# Altium schematic sheet STM32VET6.SchDoc
size A4; Organization: Altium Limited; Address1: 3 Minna Close; Address2: Belrose; Address3: NSW 2085; Address4: Australia; DocumentNumber: 1; SheetNumber: 1; SheetTotal: 1
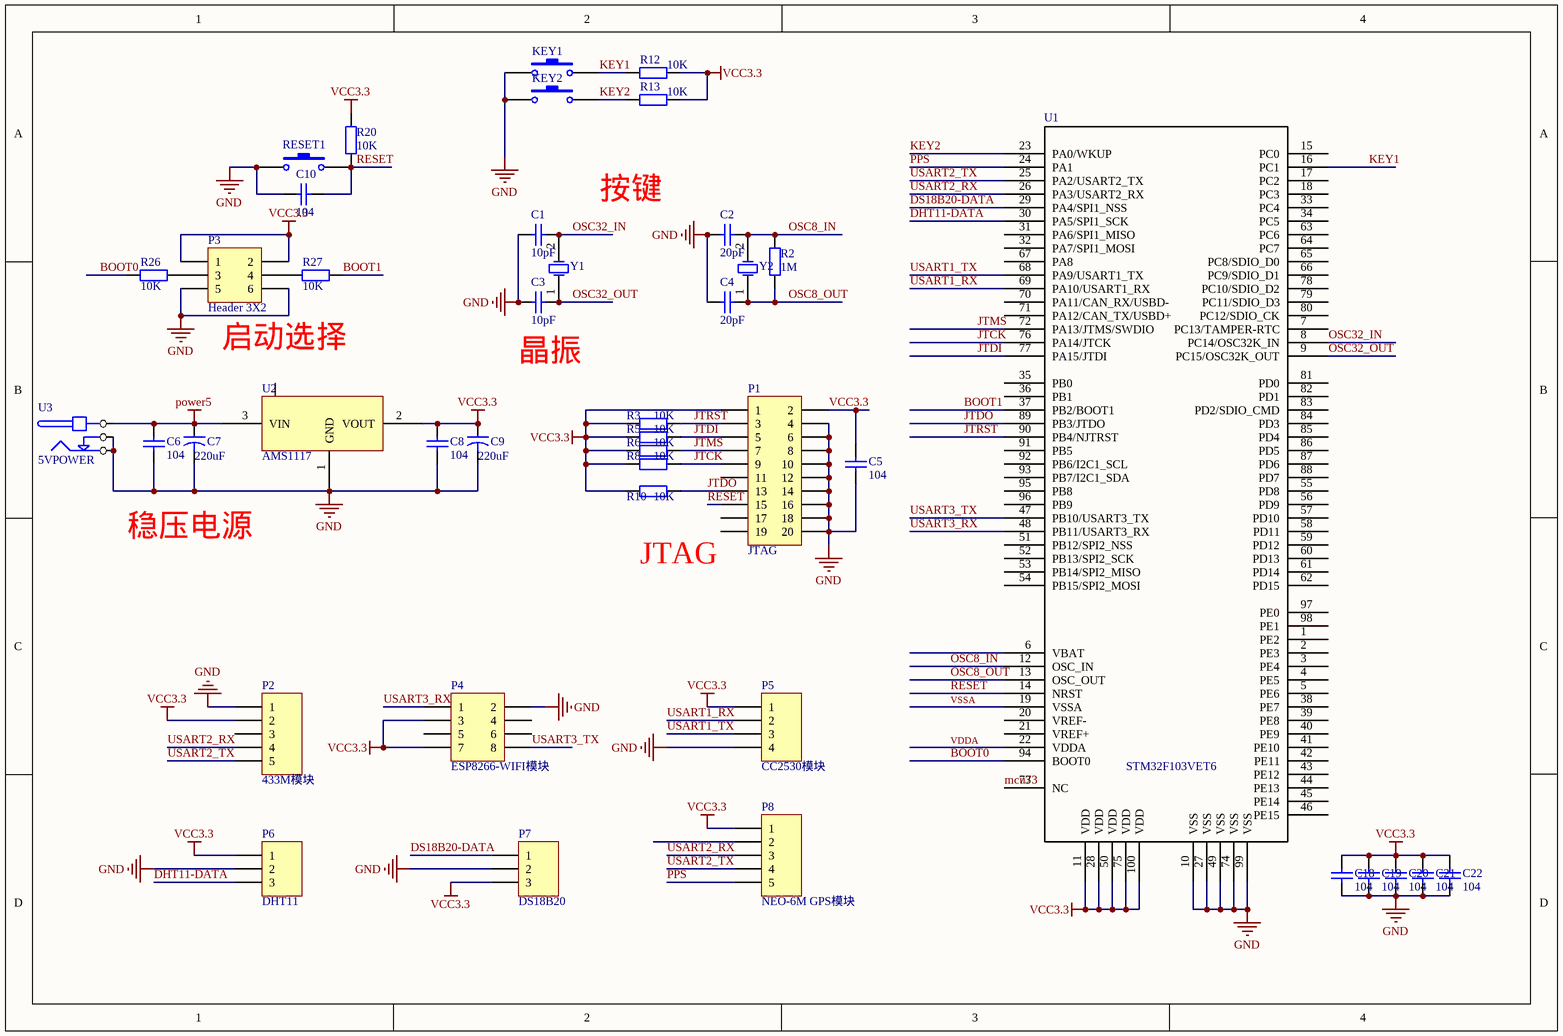
[diagram p0: STM32VET6.SchDoc]

## Parts
C1  value 10pF  [0805]  (hidden comment: Cap)
C2  value 20pF  [0805]  (hidden comment: Cap)
C3  value 10pF  [0805]  (hidden comment: Cap)
C4  value 20pF  [0805]  (hidden comment: Cap)
C5  value 104  [0805]  (hidden comment: Cap)
C6  value 104  [0805]  (hidden comment: Cap)
C7  value 220uF  [非0805贴片电容]  (hidden comment: Cap2)
C8  value 104  [0805]  (hidden comment: Cap)
C9  value 220uF  [非0805贴片电容]  (hidden comment: Cap2)
C10  value 104  [0805]  (hidden comment: Cap)
C18  value 104  [0805]  (hidden comment: Cap)
C19  value 104  [0805]  (hidden comment: Cap)
C20  value 104  [0805]  (hidden comment: Cap)
C21  value 104  [0805]  (hidden comment: Cap)
C22  value 104  [0805]  (hidden comment: Cap)
KEY1  SW-PB  [PUSHSW]  (value not drawn)
KEY2  SW-PB  [PUSHSW]  (value not drawn)
P1  JTAG  [HDR2X10]
P2  433M模块  [HDR1X5]
P3  Header 3X2  [HDR2X3]
P4  ESP8266-WIFI模块  [HDR2X4]
P5  CC2530模块  [HDR1X4]
P6  DHT11  [HDR1X3]
P7  DS18B20  [HDR1X3]
P8  NEO-6M GPS模块  [HDR1X5]
R2  value 1M  [0805]  (hidden comment: Res2)
R3  value 10K  [0805]  (hidden comment: Res2)
R5  value 10K  [0805]  (hidden comment: Res2)
R6  value 10K  [0805]  (hidden comment: Res2)
R8  value 10K  [0805]  (hidden comment: Res2)
R10  value 10K  [0805]  (hidden comment: Res2)
R12  value 10K  [0805]  (hidden comment: Res2)
R13  value 10K  [0805]  (hidden comment: Res2)
R20  value 10K  [0805]  (hidden comment: Res2)
R26  value 10K  [0805]  (hidden comment: Res2)
R27  value 10K  [0805]  (hidden comment: Res2)
RESET1  SW-PB  [PUSHSW]  (value not drawn)
U1  STM32F103VET6  [LQFP100]
U2  AMS1117  [SPX1117M]
U3  5VPOWER  [power3_1]
Y1  XTAL  [SM8]  (value not drawn)
Y2  XTAL  [XTAL-2]  (value not drawn)

## Nets
GND: C1.1 C2.1 C3.1 C4.1 C5.1 C6.1 C7.2 C8.1 C9.2 C10.1 C18.1 C19.1 C20.1 C21.1 C22.1 KEY1.1 KEY2.1 P1.4 P1.6 P1.8 P1.10 P1.12 P1.14 P1.16 P1.18 P1.20 P2.1 P3.5 P3.6 P4.2 P5.4 P6.2 P7.2 RESET1.2 U1.10(VSS) U1.27(VSS) U1.49(VSS) U1.74(VSS) U1.99(VSS) U2.1(GND) U3.1 U3.2
power5: C6.2 C7.1 U2.3(VIN) U3.3
VCC3.3: C5.2 C8.2 C9.1 C18.2 C19.2 C20.2 C21.2 C22.2 P1.1 P1.2 P2.2 P3.1 P3.2 P4.3 P4.7 P5.1 P6.1 P7.3 P8.1 R3.2 R5.2 R6.2 R8.2 R10.2 R12.1 R13.1 R20.1 U1.11(VDD) U1.28(VDD) U1.50(VDD) U1.75(VDD) U1.100(VDD) U2.2(VOUT)
BOOT0: R26.1 U1.94(BOOT0)
BOOT1: R27.2 U1.37(PB2/BOOT1)
DHT11-DATA: P6.3 U1.30(PA5/SPI1_SCK)
DS18B20-DATA: P7.1 U1.29(PA4/SPI1_NSS)
JTCK: P1.9 R8.1 U1.76(PA14/JTCK)
JTDI: P1.5 R5.1 U1.77(PA15/JTDI)
JTDO: P1.13 R10.1 U1.89(PB3/JTDO)
JTMS: P1.7 R6.1 U1.72(PA13/JTMS/SWDIO)
JTRST: P1.3 R3.1 U1.90(PB4/NJTRST)
KEY1: KEY1.2 R12.2 U1.16(PC1)
KEY2: KEY2.2 R13.2 U1.23(PA0/WKUP)
mcu73: U1.73(NC)
OSC8_IN: C2.2 R2.2 U1.12(OSC_IN) Y2.2(OSC2)
OSC8_OUT: C4.2 R2.1 U1.13(OSC_OUT) Y2.1(OSC1)
OSC32_IN: C1.2 U1.8(PC14/OSC32K_IN) Y1.2(OSC2)
OSC32_OUT: C3.2 U1.9(PC15/OSC32K_OUT) Y1.1(OSC1)
PPS: P8.5 U1.24(PA1)
RESET: C10.2 P1.15 R20.2 RESET1.1 U1.14(NRST)
USART1_RX: P5.2 U1.69(PA10/USART1_RX)
USART1_TX: P5.3 U1.68(PA9/USART1_TX)
USART2_RX: P2.4 P8.3 U1.26(PA3/USART2_RX)
USART2_TX: P2.5 P8.4 U1.25(PA2/USART2_TX)
USART3_RX: P4.1 U1.48(PB11/USART3_RX)
USART3_TX: P4.8 U1.47(PB10/USART3_TX)
VDDA: U1.22(VDDA)
VSSA: U1.19(VSSA)
NetP3_3: P3.3 R26.2
NetP3_4: P3.4 R27.1

Not connected (* = marked no-connect by the designer): P1 11 17 19; P2 3; P4 4 5 6; P8 2; U1 1(PE2) 2(PE3) 3(PE4) 4(PE5) 5(PE6) 6(VBAT) 7(PC13/TAMPER-RTC) 15(PC0) 17(PC2) 18(PC3) 20(VREF-) 21(VREF+) 31(PA6/SPI1_MISO) 32(PA7/SPI1_MOSI) 33(PC4) 34(PC5) 35(PB0) 36(PB1) 38(PE7) 39(PE8) 40(PE9) 41(PE10) 42(PE11) 43(PE12) 44(PE13) 45(PE14) 46(PE15) 51(PB12/SPI2_NSS) 52(PB13/SPI2_SCK) 53(PB14/SPI2_MISO) 54(PB15/SPI2_MOSI) 55(PD8) 56(PD9) 57(PD10) 58(PD11) 59(PD12) 60(PD13) 61(PD14) 62(PD15) 63(PC6) 64(PC7) 65(PC8/SDIO_D0) 66(PC9/SDIO_D1) 67(PA8) 70(PA11/CAN_RX/USBD-) 71(PA12/CAN_TX/USBD+) 78(PC10/SDIO_D2) 79(PC11/SDIO_D3) 80(PC12/SDIO_CK) 81(PD0) 82(PD1) 83(PD2/SDIO_CMD) 84(PD3) 85(PD4) 86(PD5) 87(PD6) 88(PD7) 91(PB5) 92(PB6/I2C1_SCL) 93(PB7/I2C1_SDA) 95(PB8) 96(PB9) 97(PE0) 98(PE1)

## Notes on the sheet
- 按键
- 启动选择
- (near C3) 晶振
- 稳压电源
- JTAG

## Library data of the parts
C1-C6 C8 C10 C18-C22 = Cap: Capacitor; Published: 8-Jun-2000; LatestRevisionDate: 17-Jul-2002; LatestRevisionNote: Re-released for DXP Platform.; PackageReference: RAD-0.3; Publisher: Altium Limited
C7 C9 = Cap2: Capacitor; Published: 23-Sep-2002; PackageReference: CAPR5-4X5; Publisher: Altium Limited
KEY1 KEY2 RESET1 = SW-PB: Switch; Published: 24-Mar-1999; LatestRevisionDate: 17-Jul-2002; LatestRevisionNote: Re-released for DXP Platform.; PackageReference: SPST-2; Publisher: Altium Limited
P1 = Header 10X2: Header, 10-Pin, Dual row; LatestRevisionDate: 17-Jul-2002; LatestRevisionNote: Re-released for DXP Platform.; Publisher: Altium Limited
P2 P8 = Header 5: Header, 5-Pin; LatestRevisionDate: 17-Jul-2002; LatestRevisionNote: Re-released for DXP Platform.; Publisher: Altium Limited
P3 = Header 3X2: Header, 3-Pin, Dual row; LatestRevisionDate: 17-Jul-2002; LatestRevisionNote: Re-released for DXP Platform.; Publisher: Altium Limited
P4 = Header 4X2: Header, 4-Pin, Dual row; LatestRevisionDate: 17-Jul-2002; LatestRevisionNote: Re-released for DXP Platform.; Publisher: Altium Limited
P5 = Header 4: Header, 4-Pin; LatestRevisionDate: 17-Jul-2002; LatestRevisionNote: Re-released for DXP Platform.; Publisher: Altium Limited
P6 P7 = Header 3: Header, 3-Pin; LatestRevisionDate: 17-Jul-2002; LatestRevisionNote: Re-released for DXP Platform.; Publisher: Altium Limited
R2 R3 R5 R6 R8 R10 R12 R13 R20 R26 R27 = Res2: Resistor; Published: 8-Jun-2000; LatestRevisionDate: 17-Jul-2002; LatestRevisionNote: Re-released for DXP Platform.; PackageReference: AXIAL-0.4; Publisher: Altium Limited
U2 = SPX1117
U3 = 9VPOWER
Y1 Y2 = XTAL: Crystal Oscillator; Published: 8-Jun-2000; LatestRevisionDate: 17-Jul-2002; LatestRevisionNote: Re-released for DXP Platform.; PackageReference: R38; Publisher: Altium Limited